# Altium schematic sheet 输出运算放大(3).SchDoc
size A4
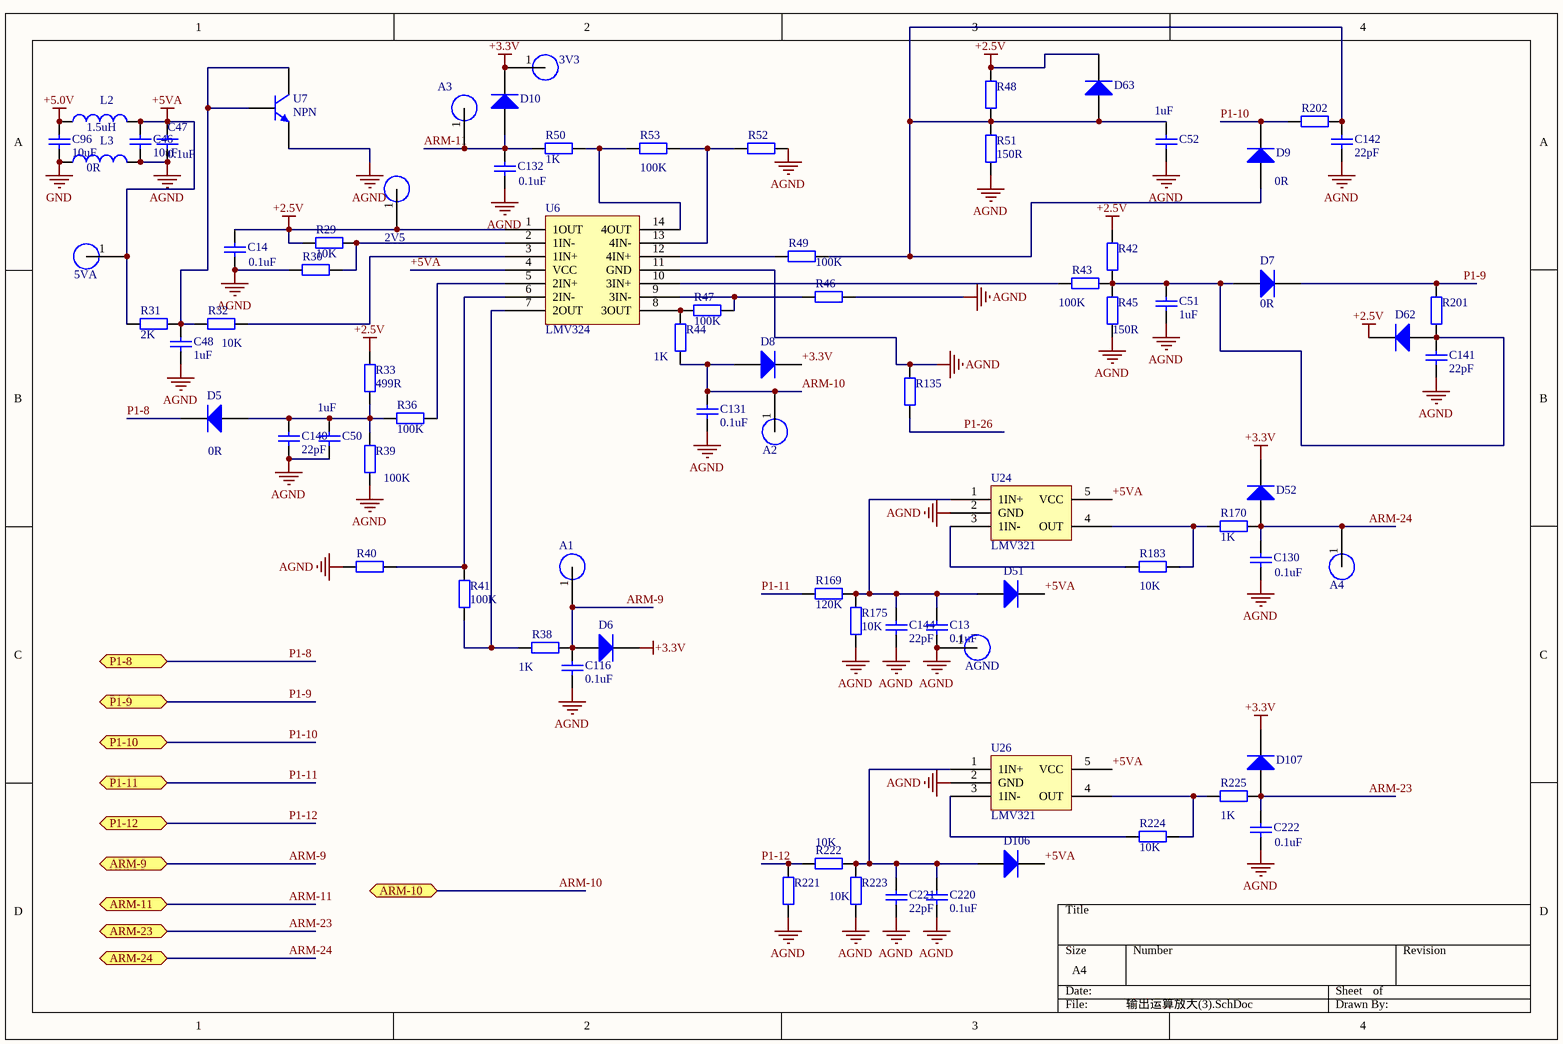
[diagram p0: 输出运算放大(3).SchDoc]

## Parts
2V5  PIN  [圆形焊盘]  (value not drawn)
3V3  PIN  [圆形焊盘]  (value not drawn)
5VA  PIN  [圆形焊盘]  (value not drawn)
A1  PIN  [圆形焊盘]  (value not drawn)
A2  PIN  [圆形焊盘]  (value not drawn)
A3  PIN  [圆形焊盘]  (value not drawn)
A4  PIN  [圆形焊盘]  (value not drawn)
AGND  PIN  [圆形焊盘]  (value not drawn)
C13  value 0.1uF  [C0805]  (hidden comment: Cap)
C14  value 0.1uF  [C0805]  (hidden comment: Cap)
C46  value 10uF  [C1206]  (hidden comment: Cap)
C47  value 0.1uF  [C0805]  (hidden comment: Cap)
C48  value 1uF  [C0805]  (hidden comment: Cap)
C50  value 1uF  [C0805]  (hidden comment: Cap)
C51  value 1uF  [C0805]  (hidden comment: Cap)
C52  value 1uF  [C0805]  (hidden comment: Cap)
C96  value 10uF  [C1206]  (hidden comment: Cap)
C116  value 0.1uF  [C0805]  (hidden comment: Cap)
C130  value 0.1uF  [C0805]  (hidden comment: Cap)
C131  value 0.1uF  [C0805]  (hidden comment: Cap)
C132  value 0.1uF  [C0805]  (hidden comment: Cap)
C140  value 22pF  [C0805]  (hidden comment: Cap)
C141  value 22pF  [C0805]  (hidden comment: Cap)
C142  value 22pF  [C0805]  (hidden comment: Cap)
C144  value 22pF  [C0805]  (hidden comment: Cap)
C220  value 0.1uF  [C0805]  (hidden comment: Cap)
C221  value 22pF  [C0805]  (hidden comment: Cap)
C222  value 0.1uF  [C0805]  (hidden comment: Cap)
D5  value 0R  [SOD123]  (hidden comment: Diode 1N4007)
D6  Diode 1N4007  [SOD123]  (value not drawn)
D7  value 0R  [SOD123]  (hidden comment: Diode 1N4007)
D8  Diode 1N4007  [SOD123]  (value not drawn)
D9  value 0R  [SOD123]  (hidden comment: Diode 1N4007)
D10  Diode 1N4007  [SOD123]  (value not drawn)
D51  Diode 1N4007  [SOD123]  (value not drawn)
D52  Diode 1N4007  [SOD123]  (value not drawn)
D62  Diode 1N4007  [SOD123]  (value not drawn)
D63  Diode 1N4007  [SOD123]  (value not drawn)
D106  Diode 1N4007  [SOD123]  (value not drawn)
D107  Diode 1N4007  [SOD123]  (value not drawn)
L2  value 1.5uH  [C1206]  (hidden comment: Inductor)
L3  value 0R  [R1206]  (hidden comment: Inductor)
R29  value 10K  [R0805]  (hidden comment: Res2)
R30  Res2  [R0805]  (value not drawn)
R31  value 2K  [R0805]  (hidden comment: Res2)
R32  value 10K  [R0805]  (hidden comment: Res2)
R33  value 499R  [R0805]  (hidden comment: Res2)
R36  value 100K  [R0805]  (hidden comment: Res2)
R38  value 1K  [R0805]  (hidden comment: Res2)
R39  value 100K  [R0805]  (hidden comment: Res2)
R40  Res2  [R0805]  (value not drawn)
R41  value 100K  [R0805]  (hidden comment: Res2)
R42  Res2  [R0805]  (value not drawn)
R43  value 100K  [R0805]  (hidden comment: Res2)
R44  value 1K  [R0805]  (hidden comment: Res2)
R45  value 150R  [R0805]  (hidden comment: 150)
R46  Res2  [R0805]  (value not drawn)
R47  value 100K  [R0805]  (hidden comment: Res2)
R48  Res2  [R0805]  (value not drawn)
R49  value 100K  [R0805]  (hidden comment: Res2)
R50  value 1K  [R0805]  (hidden comment: Res2)
R51  value 150R  [R0805]  (hidden comment: Res2)
R52  Res2  [R0805]  (value not drawn)
R53  value 100K  [R0805]  (hidden comment: Res2)
R135  Res2  [R0805]  (value not drawn)
R169  value 120K  [R0805]  (hidden comment: Res2)
R170  value 1K  [R0805]  (hidden comment: Res2)
R175  value 10K  [R0805]  (hidden comment: Res2)
R183  value 10K  [R0805]  (hidden comment: Res2)
R201  Res2  [R0805]  (value not drawn)
R202  Res2  [R0805]  (value not drawn)
R221  Res2  [R0805]  (value not drawn)
R222  value 10K  [R0805]  (hidden comment: Res2)
R223  value 10K  [R0805]  (hidden comment: Res2)
R224  value 10K  [R0805]  (hidden comment: Res2)
R225  value 1K  [R0805]  (hidden comment: Res2)
U6  LMV324  [SOP-14]
U7  NPN  [SOT23-3]
U24  LMV321  [SOT23-5]
U26  LMV321  [SOT23-5]

## Ports
ARM-9, ARM-10, ARM-11, ARM-23, ARM-24, P1-8, P1-9, P1-10, P1-11, P1-12

## Nets
+2.5V: 2V5.1 C14.2 D62.2(K) D63.2(K) R29.2 R33.2 R42.2 R48.2 U6.1(1OUT)
+3.3V: 3V3.1 D6.2(K) D8.2(K) D10.2(K) D52.2(K) D107.2(K)
+5.0V: C96.1 L2.1
+5VA: 5VA.1 C46.1 C47.2 D51.2(K) D106.2(K) L2.2 R31.1 U6.4(VCC) U24.5(VCC) U26.5(VCC)
AGND: AGND.1 C13.2 C14.1 C46.2 C47.1 C48.2 C50.1 C51.1 C52.1 C116.2 C130.1 C131.2 C132.1 C140.2 C141.2 C142.2 C144.2 C220.2 C221.2 C222.2 L3.2 R30.1 R39.2 R40.1 R45.2 R46.1 R51.2 R52.2 R135.1 R175.1 R221.2 R223.2 U6.11(GND) U7.3(E) U24.2(GND) U26.2(GND)
GND: C96.2 L3.1
ARM-9: A1.1 C116.1 D6.1(A) R38.2 ; port ARM-9
ARM-10: A2.1 C131.1 D8.1(A) R44.2 ; port ARM-10
ARM-11: A3.1 C132.2 D10.1(A) R50.1 ; port ARM-11
ARM-23: C222.1 D107.1(A) R225.2 ; port ARM-23
ARM-24: A4.1 C130.2 D52.1(A) R170.2 ; port ARM-24
P1-8: D5.2(K) ; port P1-8
P1-9: D7.2(K) R201.2 ; port P1-9
P1-10: D9.2(K) R202.2 ; port P1-10
P1-11: R169.1 ; port P1-11
P1-12: R221.1 R222.2 ; port P1-12
P1-26: R135.2
NetC13_1: C13.1 C144.1 D51.1(A) R169.2 R175.2 U24.1(1IN+)
NetC48_1: C48.1 R31.2 R32.2 U7.1(C) U7.2(B)
NetC50_2: C50.2 C140.1 D5.1(A) R33.1 R36.1 R39.1
NetC51_2: C51.2 C141.1 D7.1(A) D62.1(A) R42.1 R43.1 R45.1 R201.1
NetC52_2: C52.2 C142.1 D9.1(A) D63.1(A) R48.1 R49.1 R51.1 R202.1
NetC220_1: C220.1 C221.1 D106.1(A) R222.1 R223.1 U26.1(1IN+)
NetR29_1: R29.1 R30.2 U6.2(1IN-)
NetR32_1: R32.1 U6.3(1IN+)
NetR36_2: R36.2 U6.5(2IN+)
NetR38_1: R38.1 R41.1 U6.7(2OUT)
NetR40_2: R40.2 R41.2 U6.6(2IN-)
NetR43_2: R43.2 U6.10(3IN+)
NetR44_1: R44.1 R47.1 U6.8(3OUT)
NetR46_2: R46.2 R47.2 U6.9(3IN-)
NetR49_2: R49.2 U6.12(4IN+)
NetR50_2: R50.2 R53.2 U6.14(4OUT)
NetR52_1: R52.1 R53.1 U6.13(4IN-)
NetR170_1: R170.1 R183.1 U24.4(OUT)
NetR183_2: R183.2 U24.3(1IN-)
NetR224_1: R224.1 U26.3(1IN-)
NetR224_2: R224.2 R225.1 U26.4(OUT)

## Library data of the parts
2V5 3V3 5VA A1-A4 AGND U6 U24 U26 = Component_1
C13 C14 C46-C48 C50-C52 C96 C116 C130-C132 C140-C142 C144 C220-C222 = Cap: Capacitor; Published: 8-Jun-2000; LatestRevisionDate: 17-Jul-2002; LatestRevisionNote: Re-released for DXP Platform.; PackageReference: RAD-0.3; Publisher: Altium Limited
D5-D10 D51 D52 D62 D63 D106 D107 = Diode 1N4007: 1 Amp General Purpose Rectifier; Published: 8-Jun-2000; LatestRevisionDate: 17-Jul-2002; LatestRevisionNote: Re-released for DXP Platform.; DatasheetDocument: 1998; PackageDocument: Aug-1999; PackageReference: DO-41; Publisher: Altium Limited; Code_JEDEC: DO-204-AL; ComponentLink1Description: Manufacturer Link; ComponentLink1URL: http://www.fairchildsemi.com/; ComponentLink2Description: Datasheet; ComponentLink2URL: http://www.fairchildsemi.com/ds/1N%2F1N4001.pdf
L2 L3 = Inductor: Code_IEC: 1005; Published: 8-Jun-2000; LatestRevisionDate: 17-Jul-2002; LatestRevisionNote: Re-released for DXP Platform.; PackageReference: 0402-A; Publisher: Altium Limited; Code_JEITA: 0402
R29 R31-R33 R36 R38 R39 R41 R43-R45 R47 R49-R51 R53 R169 R170 R175 R183 R222-R225 = Res2: Resistor; Published: 8-Jun-2000; LatestRevisionDate: 17-Jul-2002; LatestRevisionNote: Re-released for DXP Platform.; PackageReference: AXIAL-0.4; Publisher: Altium Limited
R30 R40 R42 R46 R48 R52 R201 R202 R221 = Res2: Resistor; Value: NC; Published: 8-Jun-2000; LatestRevisionDate: 17-Jul-2002; LatestRevisionNote: Re-released for DXP Platform.; PackageReference: AXIAL-0.4; Publisher: Altium Limited
R135 = Res2: Resistor; Value: 0R; Published: 8-Jun-2000; LatestRevisionDate: 17-Jul-2002; LatestRevisionNote: Re-released for DXP Platform.; PackageReference: AXIAL-0.4; Publisher: Altium Limited
U7 = NPN: NPN Bipolar Transistor; Published: 8-Jun-2000; LatestRevisionDate: 17-Jul-2002; LatestRevisionNote: Re-released for DXP Platform.; PackageReference: TO-226; Publisher: Altium Limited; Code_JEDEC: TO-226-AA